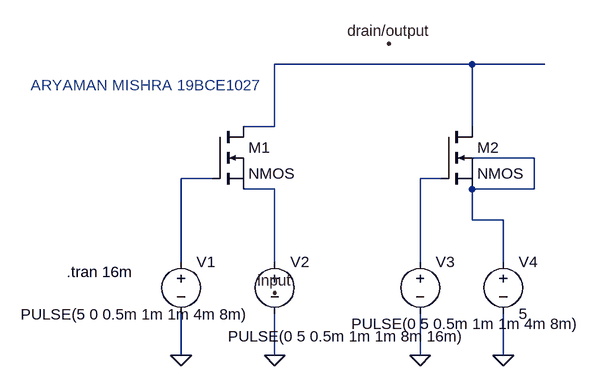
[diagram p0: schematic Draft8.asc]
Draft8.asc, the LTspice schematic file:
Version 4
SHEET 1 880 680
WIRE 368 -208 64 -208
WIRE 480 -208 368 -208
WIRE 64 -112 64 -208
WIRE 64 -112 16 -112
WIRE 368 -112 368 -208
WIRE 464 -64 368 -64
WIRE -32 -32 -80 -32
WIRE 320 -32 288 -32
WIRE 64 -16 16 -16
WIRE 464 -16 464 -64
WIRE 464 -16 368 -16
WIRE 368 32 368 -16
WIRE 416 32 368 32
WIRE -80 96 -80 -32
WIRE 64 96 64 -16
WIRE 288 96 288 -32
WIRE 416 96 416 32
WIRE -80 240 -80 176
WIRE 64 240 64 176
WIRE 288 240 288 176
WIRE 416 240 416 176
FLAG -80 240 0
FLAG 64 240 0
FLAG 288 240 0
FLAG 416 240 0
FLAG 240 -240 drain/output
FLAG 64 144 input
SYMBOL voltage -80 80 R0
WINDOW 3 -247 97 Left 2
WINDOW 123 0 0 Left 0
WINDOW 39 0 0 Left 0
SYMATTR Value PULSE(5 0 0.5m 1m 1m 4m 8m)
SYMATTR InstName V1
SYMBOL voltage 64 80 R0
WINDOW 3 -72 131 Left 2
WINDOW 123 0 0 Left 0
WINDOW 39 0 0 Left 0
SYMATTR Value PULSE(0 5 0.5m 1m 1m 8m 16m)
SYMATTR InstName V2
SYMBOL voltage 288 80 R0
WINDOW 3 -106 112 Left 2
WINDOW 123 0 0 Left 0
WINDOW 39 0 0 Left 0
SYMATTR Value PULSE(0 5 0.5m 1m 1m 4m 8m)
SYMATTR InstName V3
SYMBOL voltage 416 80 R0
WINDOW 123 0 0 Left 0
WINDOW 39 0 0 Left 0
SYMATTR InstName V4
SYMATTR Value 5
SYMBOL nmos -32 -112 R0
SYMATTR InstName M1
SYMBOL nmos 320 -112 R0
SYMATTR InstName M2
TEXT -256 112 Left 2 !.tran 16m
TEXT -312 -176 Left 2 ;ARYAMAN MISHRA 19BCE1027

The netlist it stands for:
* Draft8.asc
V1 N003 0 PULSE(5 0 0.5m 1m 1m 4m 8m)
V2 N005 0 PULSE(0 5 0.5m 1m 1m 8m 16m)
V3 N004 0 PULSE(0 5 0.5m 1m 1m 4m 8m)
V4 N002 0 5
M1 N001 N003 N005 N005 NMOS
M2 N001 N004 N002 N002 NMOS
.model NMOS NMOS
.model PMOS PMOS
.lib standard.mos
.tran 16m
* ARYAMAN MISHRA 19BCE1027
.backanno
.end